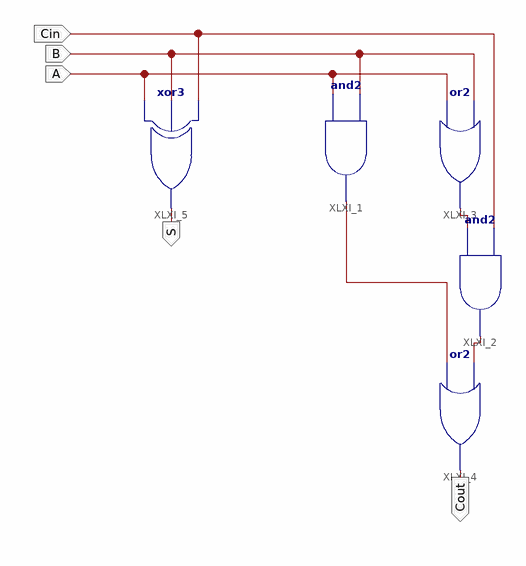
[diagram p0: schematic sheet 1]
// Xilinx ISE schematic adder_sch.sch (spartan3) as structural Verilog: 5 symbols, 5 ports
module adder_sch (
  input  Cin,
  input  B,
  input  A,
  output S,
  output Cout
);

  wire XLXN_1, XLXN_7, XLXN_8;

  and XLXI_1 (XLXN_8, A, B);
  and XLXI_2 (XLXN_7, XLXN_1, Cin);
  or XLXI_3 (XLXN_1, A, B);
  or XLXI_4 (Cout, XLXN_8, XLXN_7);
  xor XLXI_5 (S, A, B, Cin);
endmodule
